# Altium schematic sheet SoftCore_SA_P2_PG5.SchDoc: =ProjectTitle
size B; Engineer: Hab S Collector; Address1: 3621 Gin Way; Address2: Snellville GA, 30039; SheetNumber: 5; SheetTotal: 7
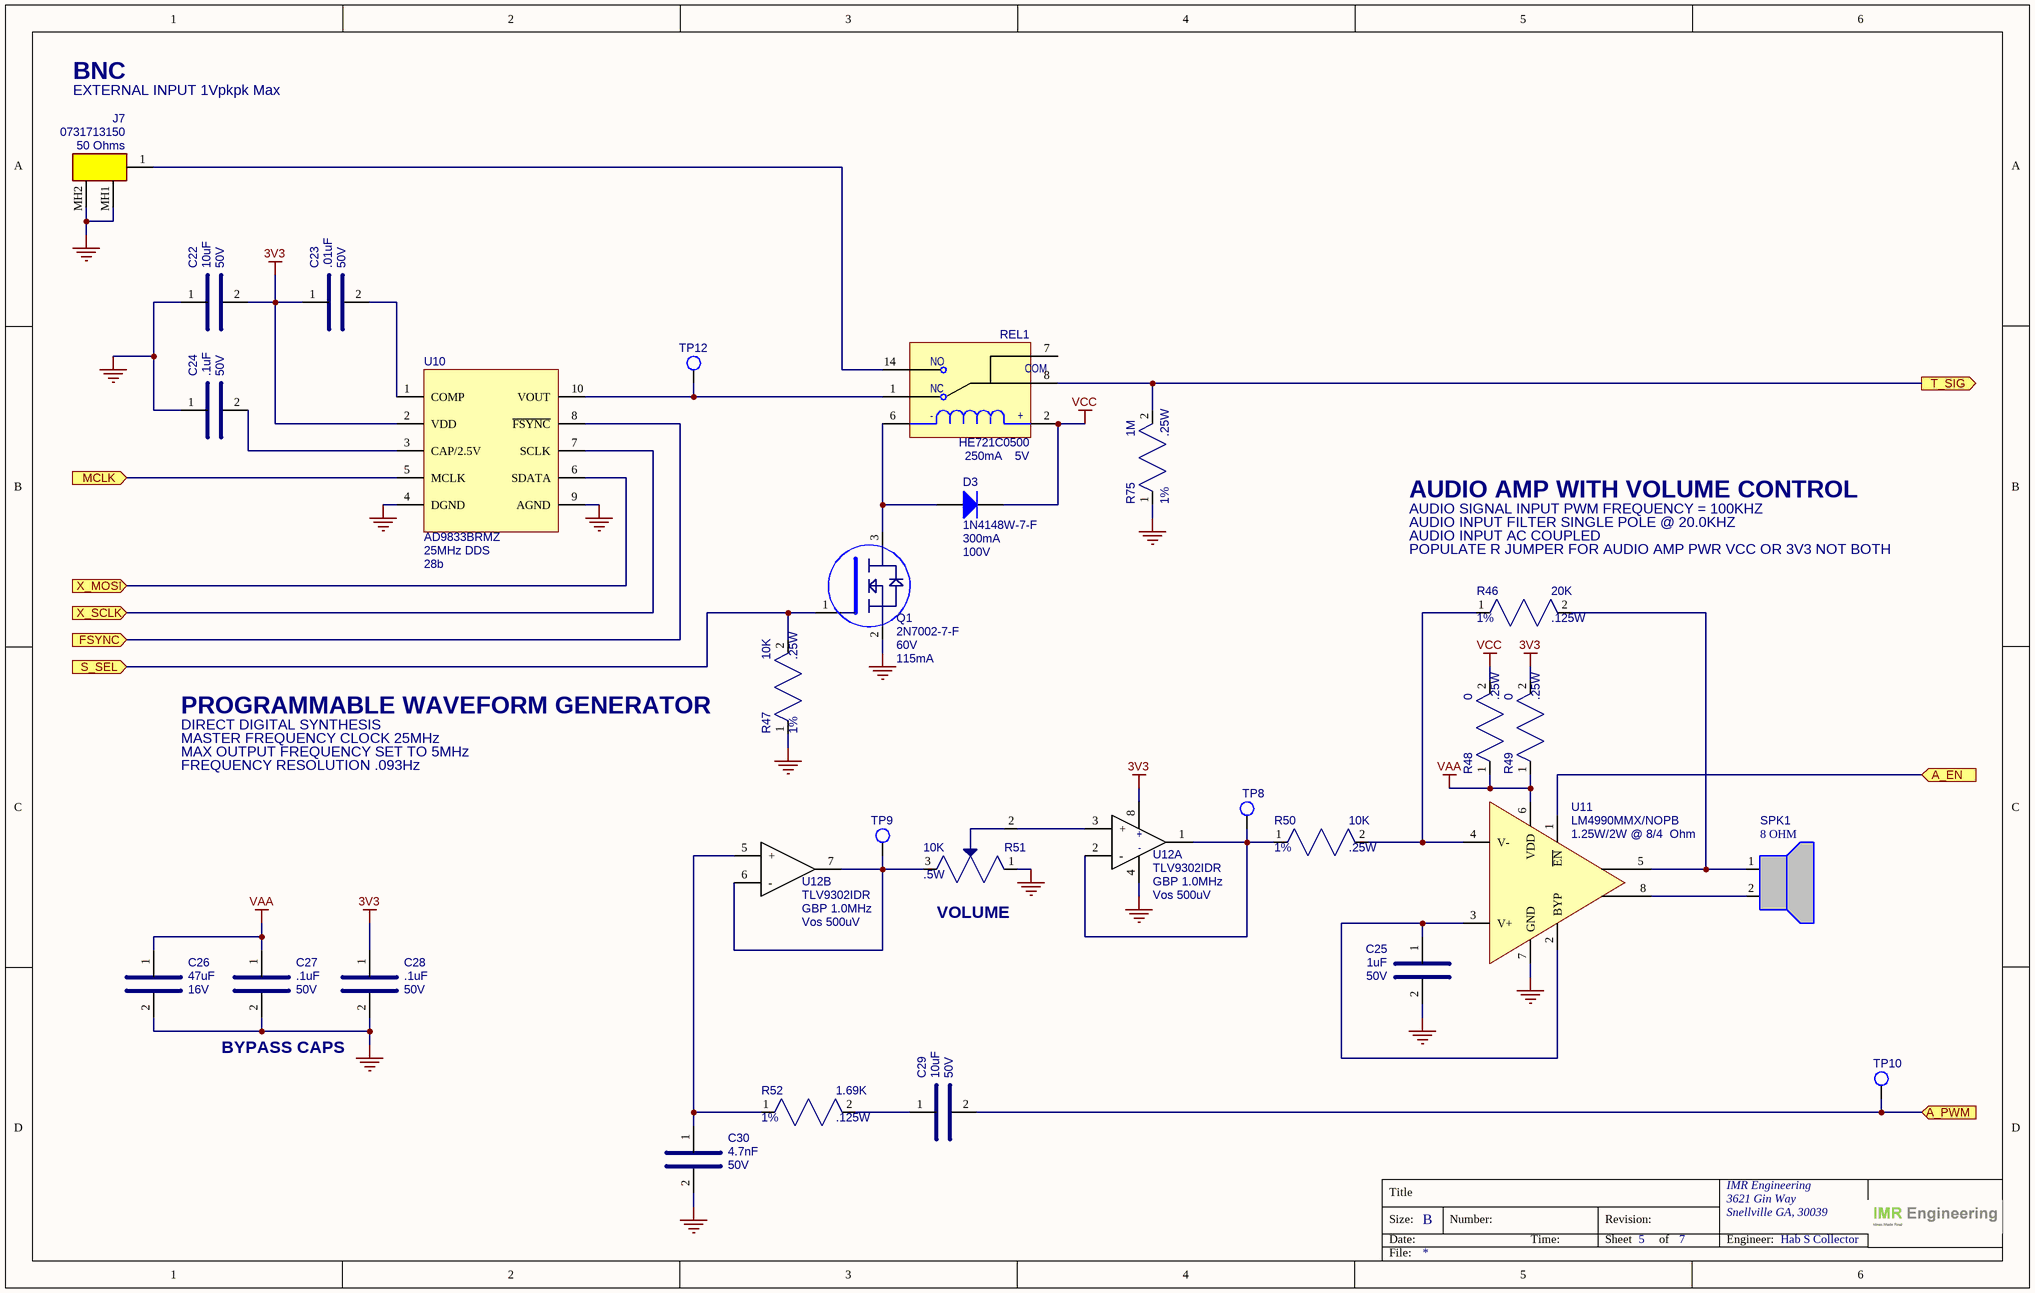
[diagram p0: SoftCore_SA_P2_PG5.SchDoc]

## Parts
C22  value 10uF  Voltage: 50V  [CAP_0805]  (hidden comment: GRM21BR61H106KE43L)
C23  value .01uF  Voltage: 50V  [CAP_0805]  (hidden comment: KGM21NR71H103KT)
C24  value .1uF  Voltage: 50V  [CAP_0805]  (hidden comment: KGM21NR71H104KT)
C25  value 1uF  Voltage: 50V  [CAP_0805]  (hidden comment: 08055C105K4T2A)
C26  value 47uF  Voltage: 16V  [CAP_1210]  (hidden comment: GRM32ER60J476ME20L)
C27  value .1uF  Voltage: 50V  [CAP_0805]  (hidden comment: KGM21NR71H104KT)
C28  value .1uF  Voltage: 50V  [CAP_0805]  (hidden comment: KGM21NR71H104KT)
C29  value 10uF  Voltage: 50V  [CAP_0805]  (hidden comment: GRM21BR61H106KE43L)
C30  value 4.7nF  Voltage: 50V  [CAP_0805]  (hidden comment: C0805C472K5RACAUTO)
D3  value 100V  Current: 300mA  [SOD123]  (hidden comment: 1N4148W-7-F)
J7  value 50 Ohms  [731713150]  (hidden comment: 0731713150)
Q1  value 60V  Current: 115mA  [SOT-23]  (hidden comment: 2N7002-7-F)
R46  value 20K  Power: .125W  Tolerance: 1%  [RES_0805]  (hidden comment: RC0805FR-0720KL)
R47  value 10K  Power: .25W  Tolerance: 1%  [RES_0805]  (hidden comment: RC0805FR-7W10KL)
R48  value 0  Power: .25W  [RES_0805]  (hidden comment: RC0805JR-070RL)
R49  value 0  Power: .25W  [RES_0805]  (hidden comment: RC0805JR-070RL)
R50  value 10K  Power: .25W  Tolerance: 1%  [RES_0805]  (hidden comment: RC0805FR-7W10KL)
R51  value 10K  Power: .5W  [BOURNS_3386F]  (hidden comment: 3386F-1-103TLF)
R52  value 1.69K  Power: .125W  Tolerance: 1%  [RES_0805]  (hidden comment: RC0805FR-071K69L)
R75  value 1M  Power: .25W  Tolerance: 1%  [RES_0805]  (hidden comment: RC0805FR-7W1ML)
REL1  value 5V  Current: 250mA  [HE700]  (hidden comment: HE721C0500)
SPK1  value 8 OHM  [HDR_1X2_100MILL]  (hidden comment: TBD)
TP8  (no value)  [TEST_POINT_35MIL_TH]  (no BOM)
TP9  (no value)  [TEST_POINT_35MIL_TH]  (no BOM)
TP10  (no value)  [TEST_POINT_35MIL_TH]  (no BOM)
TP12  (no value)  [TEST_POINT_35MIL_TH]  (no BOM)
U10  value 25MHz DDS  Tuning Word Width: 28b  [RM_10_ADI]  (hidden comment: AD9833BRMZ)
U11  value 1.25W/2W @ 8/4  Ohm  [SOP65P490X110-8N]  (hidden comment: LM4990MMX/NOPB)
U12  value GBP 1.0MHz  Vos: Vos 500uV  [SOIC-8_49]  (hidden comment: TLV9302IDR)  (parts A,B of 2)

## Ports
A_EN (in), A_PWM (in), FSYNC (in), MCLK (in), S_SEL (in), T_SIG (out), X_MOSI (in), X_SCLK (in)

## Nets
3V3: C22.2 C23.1 C28.1 R49.2 U10.2(VDD) U12.8
GND: C22.1 C24.1 C25.2 C26.2 C27.2 C28.2 C30.2 J7.MH1 J7.MH2 Q1.2(E) R47.1 R51.1 R75.1 U10.4(DGND) U10.9(AGND) U11.7(GND) U12.4
VAA: C26.1 C27.1 R48.1 R49.1 U11.6(VDD)
VCC: D3.2(K) R48.2 REL1.2
A_EN: U11.1(~{EN}) ; port A_EN
A_PWM: C29.2 TP10.1 ; port A_PWM
FSYNC: U10.8(~{FSYNC}) ; port FSYNC
MCLK: U10.5(MCLK) ; port MCLK
S_SEL: Q1.1(B) R47.2 ; port S_SEL
T_SIG: R75.2 REL1.8(COM) ; port T_SIG
X_MOSI: U10.6(SDATA) ; port X_MOSI
X_SCLK: U10.7(SCLK) ; port X_SCLK
NetC23_2: C23.2 U10.1(COMP)
NetC24_2: C24.2 U10.3(CAP/2.5V)
NetC25_1: C25.1 U11.2(BYP) U11.3(V+)
NetC29_1: C29.1 R52.2
NetC30_1: C30.1 R52.1 U12.5(+)
NetD3_1: D3.1(A) Q1.3(C) REL1.6
NetJ7_1: J7.1 REL1.14(NO)
NetR46_1: R46.1 R50.2 U11.4(V-)
NetR46_2: R46.2 SPK1.1 U11.5(VO1)
NetR50_1: R50.1 TP8.1 U12.1 U12.2(-)
NetR51_2: R51.2 U12.3(+)
NetR51_3: R51.3 TP9.1 U12.6(-) U12.7
NetREL1_1: REL1.1(NC) TP12.1 U10.10(VOUT)
NetSPK1_2: SPK1.2 U11.8(VO2)

Not connected (* = marked no-connect by the designer): REL1 7(COM)

## Notes on the sheet
- BNC
- EXTERNAL INPUT 1Vpkpk Max
- AUDIO AMP WITH VOLUME CONTROL
- POPULATE R JUMPER FOR AUDIO AMP PWR VCC OR 3V3 NOT BOTH
- AUDIO SIGNAL INPUT PWM FREQUENCY = 100KHZ
- AUDIO INPUT FILTER SINGLE POLE @ 20.0KHZ
- AUDIO INPUT AC COUPLED
- PROGRAMMABLE WAVEFORM GENERATOR
- DIRECT DIGITAL SYNTHESIS
- MASTER FREQUENCY CLOCK 25MHz
- MAX OUTPUT FREQUENCY SET TO 5MHz
- FREQUENCY RESOLUTION .093Hz
- (near R51) VOLUME
- BYPASS CAPS
- Title
- Size:
- Date:
- B
- Number:
- Time:
- Revision:
- Sheet
- of
- IMR Engineering
- Engineer:
- File:
- (in symbol RELAY_HE721C0500) -; +

## Library data of the parts
C22 C29 = CAP_SMD_10UF_50V_0805: CAP CER 10UF 50V X5R 0805; MFG: Murata Electronics; Case/Package: 0805; MFG_PN: GRM21BR61H106KE43L; Supplier 1: DigiKey; Supplier Part Number 1: 490-18663-1-ND; Unit Price: .28
C23 = CAP_SMD_0.01UF_50V_0805: CAP CER 0.01UF 50V X7R 0805; MFG: KYOCERA AVX; Case/Package: 0805; MFG_PN: KGM21NR71H103KT; Supplier 1: DigiKey; Supplier Part Number 1: 478-KGM21NR71H103KTCT-ND; Unit Price: .1
C24 C27 C28 = CAP_SMD_0.1UF_50V_0805: CAP CER 0.1UF 50V X7R 0805; MFG: KYOCERA AVX; Case/Package: 0805; MFG_PN: KGM21NR71H104KT; Supplier 1: DigiKey; Supplier Part Number 1: 478-KGM21NR71H104KTCT-ND; Unit Price: .1
C25 = CAP_SMD_1UF_50V_0805: CAP CER 1UF 50V X7R 0805; MFG: KYOCERA AVX; Case/Package: 0805; MFG_PN: 08055C105K4T2A; Supplier 1: DigiKey; Supplier Part Number 1: 478-KAM21KR71H105KUCT-ND; Unit Price: .27
C26 = CAP_SMD_47UF_16V_1210: CAP CER 47UF 50V X5R 1210; MFG: Murata Electronics; Case/Package: 1210; MFG_PN: GRM32ER60J476ME20L; Supplier 1: DigiKey; Supplier Part Number 1: 490-1887-1-ND; Unit Price: .28
C30 = CAP_SMD_4.7NF_50V_0805: CAP CER 4.7NF 50V X7R 0805; MFG: KEMET; Case/Package: 0805; MFG_PN: C0805C472K5RACAUTO; Supplier 1: DigiKey; Supplier Part Number 1: 399-6969-1-ND; Unit Price: .12
D3 = DIODE_1N4148W-7-F: RELAY REED SPDT 250MA 5V; MFG: Diodes Inc; Case/Package: SOD-123; Supplier 1: DigiKey; Supplier Part Number 1: 1N4148W-FDICT-ND; Unit Price: .16; MFG_PN: 1N4148W-7-F
J7 = CONN_MOLEX_0731713150: CONN BNC RCPT R/A 50 OHM PCB; MFG: Molex; Case/Package: 73099-2; Supplier 1: DigiKey; Supplier Part Number 1: WM20430-ND; Unit Price: 1.40; MFG_PN: 0731713150
Q1 = MOSFET_NCH_2N7002-7-F: MOSFET N-CH 60V 115MA SOT23-3; MFG: Diodes Inc; Case/Package: SOT-23; Supplier 1: DigiKey; Supplier Part Number 1: 2N7002-FDICT-ND; Unit Price: .20; MFG_PN: 2N7002-7-F
R46 = RES_SMD_20K_0805_1/8W_1%: RES SMD 20K OHM 1% 1/8W 0805; MFG: Yageo; Case/Package: 0805; MFG_PN: RC0805FR-0720KL; Supplier 1: DigiKey; Supplier Part Number 1: 311-20.0KCRCT-ND; Unit Price: .1
R47 R50 = RES_SMD_10K_0805_1/4W_1%: RES SMD 10K OHM 1% 1/4W 0805; MFG: Yageo; Case/Package: 0805; MFG_PN: RC0805FR-7W10KL; Supplier 1: DigiKey; Supplier Part Number 1: 13-RC0805FR-7W10KLCT-ND; Unit Price: .10
R48 R49 = RES_SMD_0_0805_1/8W_1%: RES SMD 0 OHM 1% 1/8W 0805; MFG: Yageo; Case/Package: 0805; MFG_PN: RC0805JR-070RL; Supplier 1: DigiKey; Supplier Part Number 1: 311-0.0ARCT-ND; Unit Price: .1; Tolerance: 1%
R51 = RES_POT_10K_1XGANG_LINEAR: POT 10K OHM 1/20W LINEAR - 1X GANG; MFG: Bourns Inc.; Case/Package: 3386F; MFG_PN: 3386F-1-103TLF; Supplier 1: DigiKey; Supplier Part Number 1: 3386F-103TLF-ND; Unit Price: 2.26
R52 = RES_SMD_1.69K_0805_1/8W_1%: RES SMD 1.69K OHM 1% 1/8W 0805; MFG: Yageo; Case/Package: 0805; MFG_PN: RC0805FR-071K69L; Supplier 1: DigiKey; Supplier Part Number 1: 311-1.69KCRCT-ND; Unit Price: .1
R75 = RES_SMD_1M_0805_1/4W_1%: RES SMD 1M OHM 1% 1/4W 0805; MFG: Yageo; Case/Package: 0805; MFG_PN: RC0805FR-7W1ML; Supplier 1: DigiKey; Supplier Part Number 1: 13-RC0805FR-7W1MLCT-ND; Unit Price: .10
REL1 = RELAY_HE721C0500: RELAY REED SPDT 250MA 5V; MFG: Littlefuse; Case/Package: HE700; Supplier 1: DigiKey; Supplier Part Number 1: HE112-ND; Unit Price: 3.77; MFG_PN: HE721C0500
SPK1 = CONN_SPKR_HEADER_2P_100MIL: CONN SPEAKER HEADER GENERIC VERT 2POS 2.54MM; Case/Package: 2P_2.54MM; MFG: GENERIC; Supplier 1: Digi-Key; Supplier Part Number 1: TBD; Unit Price: 1.00; MFG_PN: TBD
TP8-TP10 TP12 = CONN_TEST_POINT_TH_PROBE_TIP: TEST POINT TH FITS DSO PROBE TIP
U10 = IC_AD9833BRMZ: IC DDS 25MHZ 10BIT 10MSOP; MFG: Analog Devices; Case/Package: 10-MSOP; Supplier 1: DigiKey; Supplier Part Number 1: 505-AD9833BRMZ-ND; Unit Price: 15.19; MFG_PN: AD9833BRMZ
U11 = IC_LM4990MMX/NOPB: IC AMP CLASS AB MONO 2W 8VSSOP; MFG: Texas Instruments; Case/Package: SC-70-6; Supplier 1: DigiKey; Supplier Part Number 1: 296-37579-1-ND; Unit Price: .45; MFG_PN: LM4990MMX/NOPB
U12 = IC_OPAMP_TLV9302IDR: IC OPAMP GP 2 CIRCUIT 8SOIC; MFG: Texas Instruments; Unit Price: .66; Package/Case: SOIC-8; Supplier 1: DigiKey; Supplier Part Number 1: 296-53513-1-ND; MFG_PN: TLV9302IDR